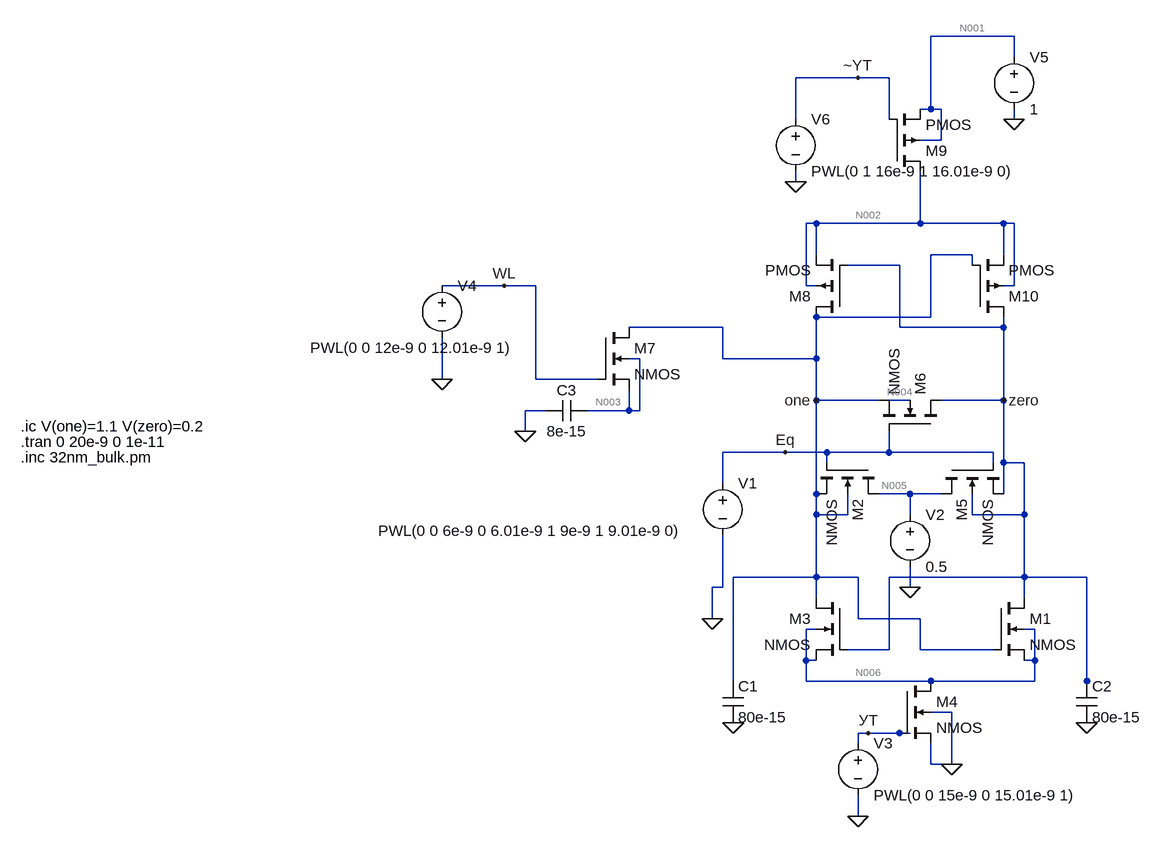
[diagram p0: schematic full_amplifaer.asc]
full_amplifaer.asc, the LTspice schematic file:
Version 4
SHEET 1 980 680
WIRE 464 -576 336 -576
WIRE 464 -544 464 -576
WIRE 224 -512 128 -512
WIRE 272 -512 224 -512
WIRE 336 -464 336 -576
WIRE 336 -464 320 -464
WIRE 352 -464 336 -464
WIRE 128 -448 128 -512
WIRE 272 -448 272 -512
WIRE 464 -448 464 -464
WIRE 352 -416 352 -464
WIRE 352 -416 320 -416
WIRE 128 -352 128 -368
WIRE 160 -288 144 -288
WIRE 320 -288 320 -368
WIRE 320 -288 160 -288
WIRE 448 -288 320 -288
WIRE 464 -288 448 -288
WIRE 160 -240 160 -288
WIRE 400 -240 336 -240
WIRE 448 -240 448 -288
WIRE 288 -224 208 -224
WIRE 400 -224 400 -240
WIRE -320 -192 -416 -192
WIRE -272 -192 -320 -192
WIRE 144 -192 144 -288
WIRE 160 -192 144 -192
WIRE 464 -192 464 -288
WIRE 464 -192 448 -192
WIRE 336 -144 336 -240
WIRE 336 -144 160 -144
WIRE 16 -128 -128 -128
WIRE 288 -128 288 -224
WIRE 448 -128 448 -144
WIRE 448 -128 288 -128
WIRE -112 -80 -128 -80
WIRE 16 -80 16 -128
WIRE 160 -80 160 -144
WIRE 160 -80 16 -80
WIRE -416 -48 -416 -112
WIRE -272 -48 -272 -192
WIRE -176 -48 -272 -48
WIRE 160 -16 160 -80
WIRE 256 -16 160 -16
WIRE 304 -16 272 -16
WIRE 448 -16 448 -128
WIRE 448 -16 352 -16
WIRE -256 0 -288 0
WIRE -128 0 -128 -32
WIRE -128 0 -192 0
WIRE -112 0 -112 -80
WIRE -112 0 -128 0
WIRE -288 32 -288 0
WIRE 112 64 16 64
WIRE 176 64 112 64
WIRE 272 64 272 32
WIRE 272 64 176 64
WIRE 432 64 272 64
WIRE 176 80 176 64
WIRE 432 80 432 64
WIRE 448 80 448 -16
WIRE 480 80 448 80
WIRE 16 112 16 64
WIRE 160 128 160 -16
WIRE 304 128 256 128
WIRE 352 128 304 128
WIRE 448 128 448 80
WIRE 160 160 160 128
WIRE 208 160 208 128
WIRE 208 160 160 160
WIRE 304 160 304 128
WIRE 400 160 400 128
WIRE 480 160 480 80
WIRE 480 160 400 160
WIRE 160 256 160 160
WIRE 160 256 32 256
WIRE 224 256 160 256
WIRE 480 256 480 160
WIRE 480 256 272 256
WIRE 576 256 480 256
WIRE 16 272 16 192
WIRE 16 272 0 272
WIRE 304 272 304 240
WIRE 160 288 160 256
WIRE 480 288 480 256
WIRE 0 320 0 272
WIRE 224 320 224 256
WIRE 320 320 224 320
WIRE 160 336 144 336
WIRE 496 336 480 336
WIRE 272 368 272 256
WIRE 272 368 208 368
WIRE 320 368 320 320
WIRE 432 368 320 368
WIRE 144 384 144 336
WIRE 160 384 144 384
WIRE 496 384 496 336
WIRE 496 384 480 384
WIRE 32 416 32 256
WIRE 144 416 144 384
WIRE 336 416 144 416
WIRE 496 416 496 384
WIRE 496 416 336 416
WIRE 576 416 576 256
WIRE 576 432 576 416
WIRE 368 464 336 464
WIRE 240 496 224 496
WIRE 288 496 240 496
WIRE 304 496 288 496
WIRE 224 512 224 496
WIRE 336 544 336 512
WIRE 368 544 368 464
WIRE 368 544 336 544
WIRE 224 624 224 592
FLAG 0 320 0
FLAG 160 -16 one
FLAG 448 -16 zero
FLAG 304 272 0
FLAG 576 480 0
FLAG 32 480 0
FLAG 368 544 0
FLAG 224 624 0
FLAG -288 32 0
FLAG -416 -48 0
FLAG 112 64 Eq
FLAG 240 496 УТ
FLAG -320 -192 WL
FLAG 464 -448 0
FLAG 128 -352 0
FLAG 224 -512 ~YT
SYMBOL voltage 16 96 R0
WINDOW 3 -530 89 Left 2
WINDOW 123 0 0 Left 0
WINDOW 39 0 0 Left 0
SYMATTR Value PWL(0 0 6e-9 0 6.01e-9 1 9e-9 1 9.01e-9 0)
SYMATTR InstName V1
SYMBOL voltage 304 144 R0
WINDOW 123 0 0 Left 0
WINDOW 39 0 0 Left 0
SYMATTR InstName V2
SYMATTR Value 0.5
SYMBOL cap 16 416 R0
SYMATTR InstName C1
SYMATTR Value 80e-15
SYMBOL cap 560 416 R0
SYMATTR InstName C2
SYMATTR Value 80e-15
SYMBOL voltage 224 496 R0
WINDOW 123 0 0 Left 0
WINDOW 39 0 0 Left 0
SYMATTR InstName V3
SYMATTR Value PWL(0 0 15e-9 0 15.01e-9 1)
SYMBOL nmos4 -176 -128 R0
SYMATTR InstName M7
SYMATTR Value2 l=130e-9 w=1300e-9 ad=676000e-18 as=676000e-18 pd=3640e-9 ps=3640e-9
SYMBOL cap -192 -16 R90
WINDOW 0 0 32 VBottom 2
WINDOW 3 32 32 VTop 2
SYMATTR InstName C3
SYMATTR Value 8e-15
SYMBOL voltage -416 -208 R0
WINDOW 123 0 0 Left 0
WINDOW 39 0 0 Left 0
WINDOW 3 -203 111 Left 2
SYMATTR InstName V4
SYMATTR Value PWL(0 0 12e-9 0 12.01e-9 1)
SYMBOL voltage 464 -560 R0
WINDOW 123 0 0 Left 0
WINDOW 39 0 0 Left 0
SYMATTR InstName V5
SYMATTR Value 1
SYMBOL voltage 128 -464 R0
WINDOW 123 0 0 Left 0
WINDOW 39 0 0 Left 0
SYMATTR InstName V6
SYMATTR Value PWL(0 1 16e-9 1 16.01e-9 0)
SYMBOL pmos4 272 -368 M180
SYMATTR InstName M9
SYMATTR Value2 l=32e-9 w=640e-9 ad=51200e-18 as=51200e-18 pd=960e-9 ps=960e-9
SYMBOL pmos4 400 -144 M180
SYMATTR InstName M10
SYMATTR Value2 l=32e-9 w=640e-9 ad=51200e-18 as=51200e-18 pd=960e-9 ps=960e-9
SYMBOL pmos4 208 -144 R180
SYMATTR InstName M8
SYMATTR Value2 l=32e-9 w=640e-9 ad=51200e-18 as=51200e-18 pd=960e-9 ps=960e-9
SYMBOL nmos4 432 288 R0
SYMATTR InstName M1
SYMATTR Value2 l=32e-9 w=320e-9 ad=51200e-18 as=51200e-18 pd=960e-9 ps=960e-9
SYMBOL nmos4 208 288 M0
SYMATTR InstName M3
SYMATTR Value2 l=32e-9 w=320e-9 ad=51200e-18 as=51200e-18 pd=960e-9 ps=960e-9
SYMBOL nmos4 288 416 R0
SYMATTR InstName M4
SYMATTR Value2 l=32e-9 w=320e-9 ad=51200e-18 as=51200e-18 pd=960e-9 ps=960e-9
SYMBOL nmos4 352 80 M90
SYMATTR InstName M5
SYMATTR Value2 l=32e-9 w=320e-9 ad=51200e-18 as=51200e-18 pd=960e-9 ps=960e-9
SYMBOL nmos4 352 32 M270
SYMATTR InstName M6
SYMATTR Value2 l=32e-9 w=320e-9 ad=51200e-18 as=51200e-18 pd=960e-9 ps=960e-9
SYMBOL nmos4 256 80 R90
SYMATTR InstName M2
SYMATTR Value2 l=32e-9 w=320e-9 ad=51200e-18 as=51200e-18 pd=960e-9 ps=960e-9
TEXT -1064 72 Left 2 !.inc 32nm_bulk.pm
TEXT -1064 48 Left 2 !.tran 0 20e-9 0 1e-11
TEXT -1064 24 Left 2 !.ic V(one)=1.1 V(zero)=0.2

The netlist it stands for:
* full_amplifaer.asc
V1 Eq 0 PWL(0 0 6e-9 0 6.01e-9 1 9e-9 1 9.01e-9 0)
V2 N005 0 0.5
C1 one 0 80e-15
C2 zero 0 80e-15
V3 УТ 0 PWL(0 0 15e-9 0 15.01e-9 1)
M7 one WL N003 N003 NMOS l=130e-9 w=1300e-9 ad=676000e-18 as=676000e-18 pd=3640e-9 ps=3640e-9
C3 N003 0 8e-15
V4 WL 0 PWL(0 0 12e-9 0 12.01e-9 1)
V5 N001 0 1
V6 ~YT 0 PWL(0 1 16e-9 1 16.01e-9 0)
M9 N002 ~YT N001 N001 PMOS l=32e-9 w=640e-9 ad=51200e-18 as=51200e-18 pd=960e-9 ps=960e-9
M10 zero one N002 N002 PMOS l=32e-9 w=640e-9 ad=51200e-18 as=51200e-18 pd=960e-9 ps=960e-9
M8 one zero N002 N002 PMOS l=32e-9 w=640e-9 ad=51200e-18 as=51200e-18 pd=960e-9 ps=960e-9
M1 zero one N006 N006 NMOS l=32e-9 w=320e-9 ad=51200e-18 as=51200e-18 pd=960e-9 ps=960e-9
M3 one zero N006 N006 NMOS l=32e-9 w=320e-9 ad=51200e-18 as=51200e-18 pd=960e-9 ps=960e-9
M4 N006 УТ 0 0 NMOS l=32e-9 w=320e-9 ad=51200e-18 as=51200e-18 pd=960e-9 ps=960e-9
M5 N005 Eq zero zero NMOS l=32e-9 w=320e-9 ad=51200e-18 as=51200e-18 pd=960e-9 ps=960e-9
M6 zero Eq one N004 NMOS l=32e-9 w=320e-9 ad=51200e-18 as=51200e-18 pd=960e-9 ps=960e-9
M2 N005 Eq one one NMOS l=32e-9 w=320e-9 ad=51200e-18 as=51200e-18 pd=960e-9 ps=960e-9
.model NMOS NMOS
.model PMOS PMOS
.lib standard.mos
.inc 32nm_bulk.pm
.tran 0 20e-9 0 1e-11
.ic V(one)=1.1 V(zero)=0.2
.backanno
.end

* Results of the author's LTspice run, read from the files saved beside the schematic
* Operating Point, zero values left out:
*   V(n005) = 500 mV
*   V(one) = 1.1 V
*   V(zero) = 200 mV
*   V(n003) = 144.4 mV
*   V(n001) = 1 V
*   V(~yt) = 1 V
*   V(n002) = 1.1 V
*   V(n006) = 200 mV
*   V(n004) = 400.1 mV
*   Id(M8) = 115.7 nA
*   Ig(M8) = -53.56 pA
*   Is(M8) = -115.6 nA
*   Id(M10) = -108.4 nA
*   Ig(M10) = 26.78 pA
*   Is(M10) = 108.4 nA
*   Id(M9) = 7.261 nA
*   Is(M9) = -7.261 nA
*   Id(M2) = -516.9 nA
*   Ig(M2) = -3.469 nA
*   Ib(M2) = 517.2 nA
*   Is(M2) = 3.195 nA
*   Id(M6) = -2.837 nA
*   Ig(M6) = -3.098 nA
*   Is(M6) = 5.935 nA
*   Id(M5) = 109.3 pA
*   Ig(M5) = -86.52 pA
*   Is(M5) = -22.53 pA
*   Id(M4) = 1.568 nA
*   Ig(M4) = -4.702 pA
*   Is(M4) = -1.563 nA
*   Id(M3) = 68.09 nA
*   Ig(M3) = -1.043 nA
*   Is(M3) = -67.04 nA
*   Id(M1) = -68.82 nA
*   Ig(M1) = 3.347 nA
*   Is(M1) = 65.48 nA
*   Id(M7) = 12.88 nA
*   Ig(M7) = -12.88 nA
*   I(V5) = 7.261 nA
*   I(V4) = 12.88 nA
*   I(V3) = 4.702 pA
*   I(V2) = 516.8 nA
*   I(V1) = 6.654 nA
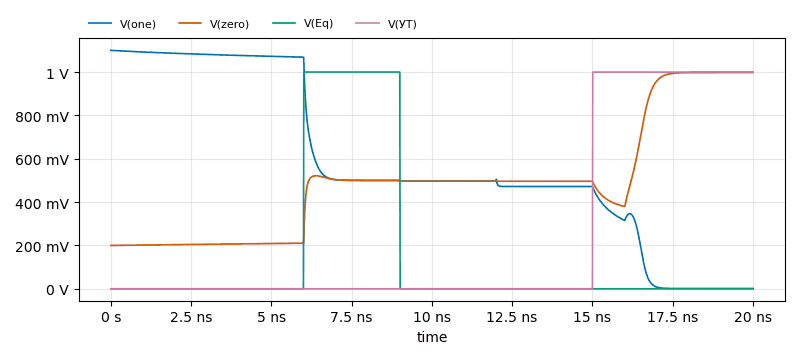
[diagram p1: Transient Analysis of full_amplifaer.asc, plotted from the saved traces]
* Transient Analysis, 1 run:
*   V(one): min 1.317 mV, max 1.1 V, average 578.6 mV, rms 689.8 mV, last 1.317 mV
*   V(zero): min 200 mV, max 997.9 mV, average 490.3 mV, rms 554.3 mV, last 997.9 mV
*   V(Eq): min 0 V, max 1 V, average 150 mV, rms 387.1 mV, last 0 V
*   V(УТ): min 0 V, max 1 V, average 249.7 mV, rms 499.7 mV, last 1 V